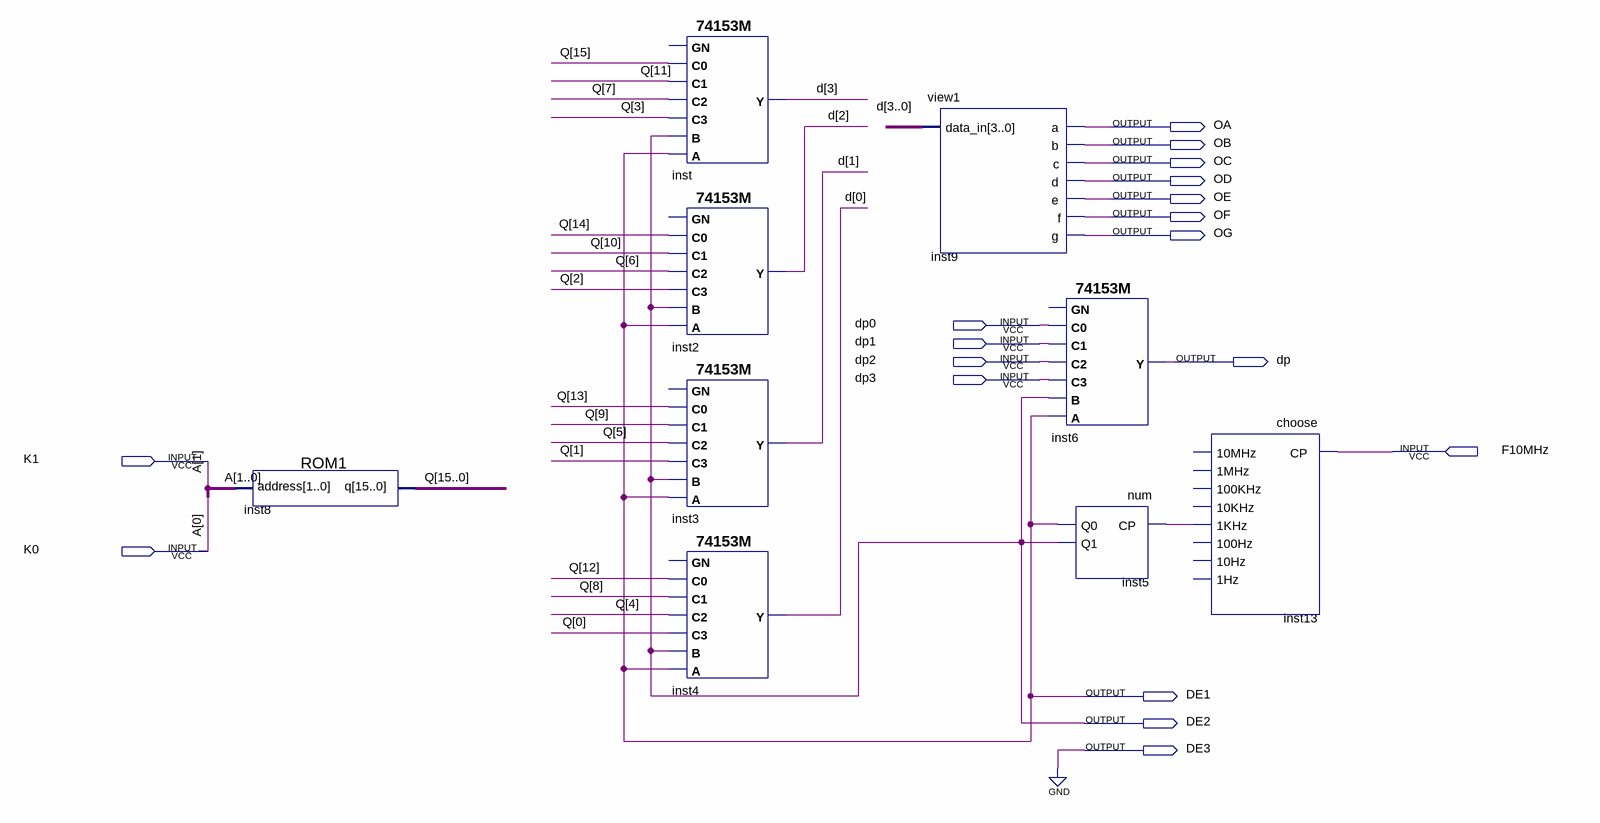
[diagram p0: schematic sheet]
// Quartus schematic view.bdf as structural Verilog: 9 symbols, 18 pins
module view (
  input  dp0,
  input  dp1,
  input  dp2,
  input  dp3,
  input  F10MHz,
  input  K1,
  input  K0,
  output OA,
  output OB,
  output OC,
  output OD,
  output OE,
  output OF,
  output OG,
  output dp,
  output DE1,
  output DE2,
  output DE3
);

  wire inst13_1khz;
  wire [3:0] d;
  wire [15:0] Q;

  ROM1 inst8 (.address({K1, K0}), .q(Q));
  \74153M  inst (.A(DE1), .B(DE2), .C3(Q[3]), .C2(Q[7]), .C1(Q[11]), .C0(Q[15]), .Y(d[3]));  // open: GN
  \74153M  inst2 (.A(DE1), .B(DE2), .C3(Q[2]), .C2(Q[6]), .C1(Q[10]), .C0(Q[14]), .Y(d[2]));  // open: GN
  \74153M  inst3 (.A(DE1), .B(DE2), .C3(Q[1]), .C2(Q[5]), .C1(Q[9]), .C0(Q[13]), .Y(d[1]));  // open: GN
  \74153M  inst4 (.A(DE1), .B(DE2), .C3(Q[0]), .C2(Q[4]), .C1(Q[8]), .C0(Q[12]), .Y(d[0]));  // open: GN
  view1 inst9 (.data_in(d), .a(OA), .b(OB), .c(OC), .d(OD), .e(OE), .f(OF), .g(OG));
  \74153M  inst6 (.A(DE1), .B(DE2), .C3(dp3), .C2(dp2), .C1(dp1), .C0(dp0), .Y(dp));  // open: GN
  num inst5 (.CP(inst13_1khz), .Q0(DE1), .Q1(DE2));
  choose inst13 (.CP(F10MHz), .\1KHz (inst13_1khz));  // open: 10MHz, 1MHz, 100KHz, 10KHz, 100Hz, 10Hz, 1Hz

  assign DE3 = 1'b0;

  // Other names for the same wires on the sheet: A[1:0] = {K1, K0}
endmodule
